# Altium schematic sheet P20 HDMI TX FPC & Hole.SchDoc
size 467 x 304 mm
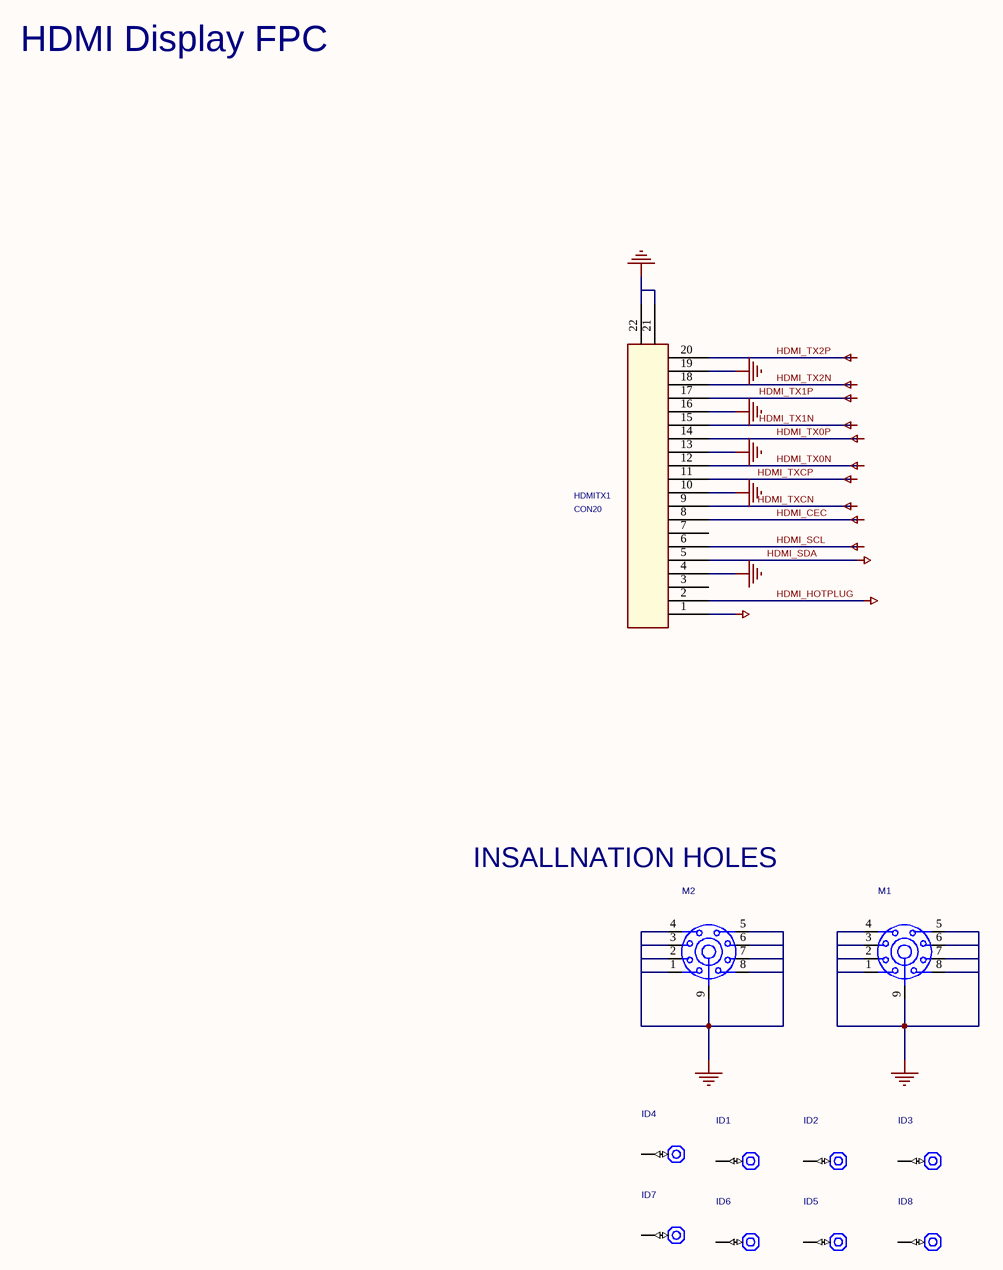
[diagram p0: P20 HDMI TX FPC & Hole.SchDoc]

## Parts
HDMITX1  CON20  [FPC20_05MM]
ID1  ID-BOARD  [PAD_NC]  (value not drawn)
ID2  ID-BOARD  [PAD_NC]  (value not drawn)
ID3  ID-BOARD  [PAD_NC]  (value not drawn)
ID4  ID-BOARD  [PAD_NC]  (value not drawn)
ID5  ID-BOARD  [PAD_NC]  (value not drawn)
ID6  ID-BOARD  [PAD_NC]  (value not drawn)
ID7  ID-BOARD  [PAD_NC]  (value not drawn)
ID8  ID-BOARD  [PAD_NC]  (value not drawn)
M1  HOLE-8STARS  [MTH_C6MMD3P2MM]  (value not drawn)
M2  HOLE-8STARS  [MTH_C6MMD3P2MM]  (value not drawn)

## Nets
3V3: HDMITX1.1
GND: HDMITX1.4 HDMITX1.10 HDMITX1.13 HDMITX1.16 HDMITX1.19 HDMITX1.21 HDMITX1.22 M1.1(GND0) M1.2(GND1) M1.3(GND2) M1.4(GND3) M1.5(GND4) M1.6(GND5) M1.7(GND6) M1.8(GND7) M1.9(HOLE) M2.1(GND0) M2.2(GND1) M2.3(GND2) M2.4(GND3) M2.5(GND4) M2.6(GND5) M2.7(GND6) M2.8(GND7) M2.9(HOLE)
HDMI_CEC: HDMITX1.8
HDMI_HOTPLUG: HDMITX1.2
HDMI_SCL: HDMITX1.6
HDMI_SDA: HDMITX1.5
HDMI_TX0N: HDMITX1.12
HDMI_TX0P: HDMITX1.14
HDMI_TX1N: HDMITX1.15
HDMI_TX1P: HDMITX1.17
HDMI_TX2N: HDMITX1.18
HDMI_TX2P: HDMITX1.20
HDMI_TXCN: HDMITX1.9
HDMI_TXCP: HDMITX1.11

Not connected (* = marked no-connect by the designer): HDMITX1 3 7; ID1 1; ID2 1; ID3 1; ID4 1; ID5 1; ID6 1; ID7 1; ID8 1

## Notes on the sheet
- HDMI Display FPC
- INSALLNATION HOLES

## Library data of the parts
HDMITX1 = CON20_0
ID1-ID8 = ID-BOARD: PARTS: 1; OriginalSymbolOrigin: (0,0); LEVEL: STD; PKG_TYPE: ID-BOARD; DEVICE: ID-BOARD
M1 M2 = HOLE-8STARS: PARTS: 1; OriginalSymbolOrigin: (0,0); LEVEL: STD; PKG_TYPE: MTH_C6MMD3P2MM; DEVICE: HOLE-8STARS